# Altium schematic sheet Regulators.SchDoc: Regulators
size B; Organization: Myomo; Address1: 137 PORTLAND STREET, 4TH FLOOR; Address2: BOSTON, MA 02114; Address3: USA; SheetNumber: 2
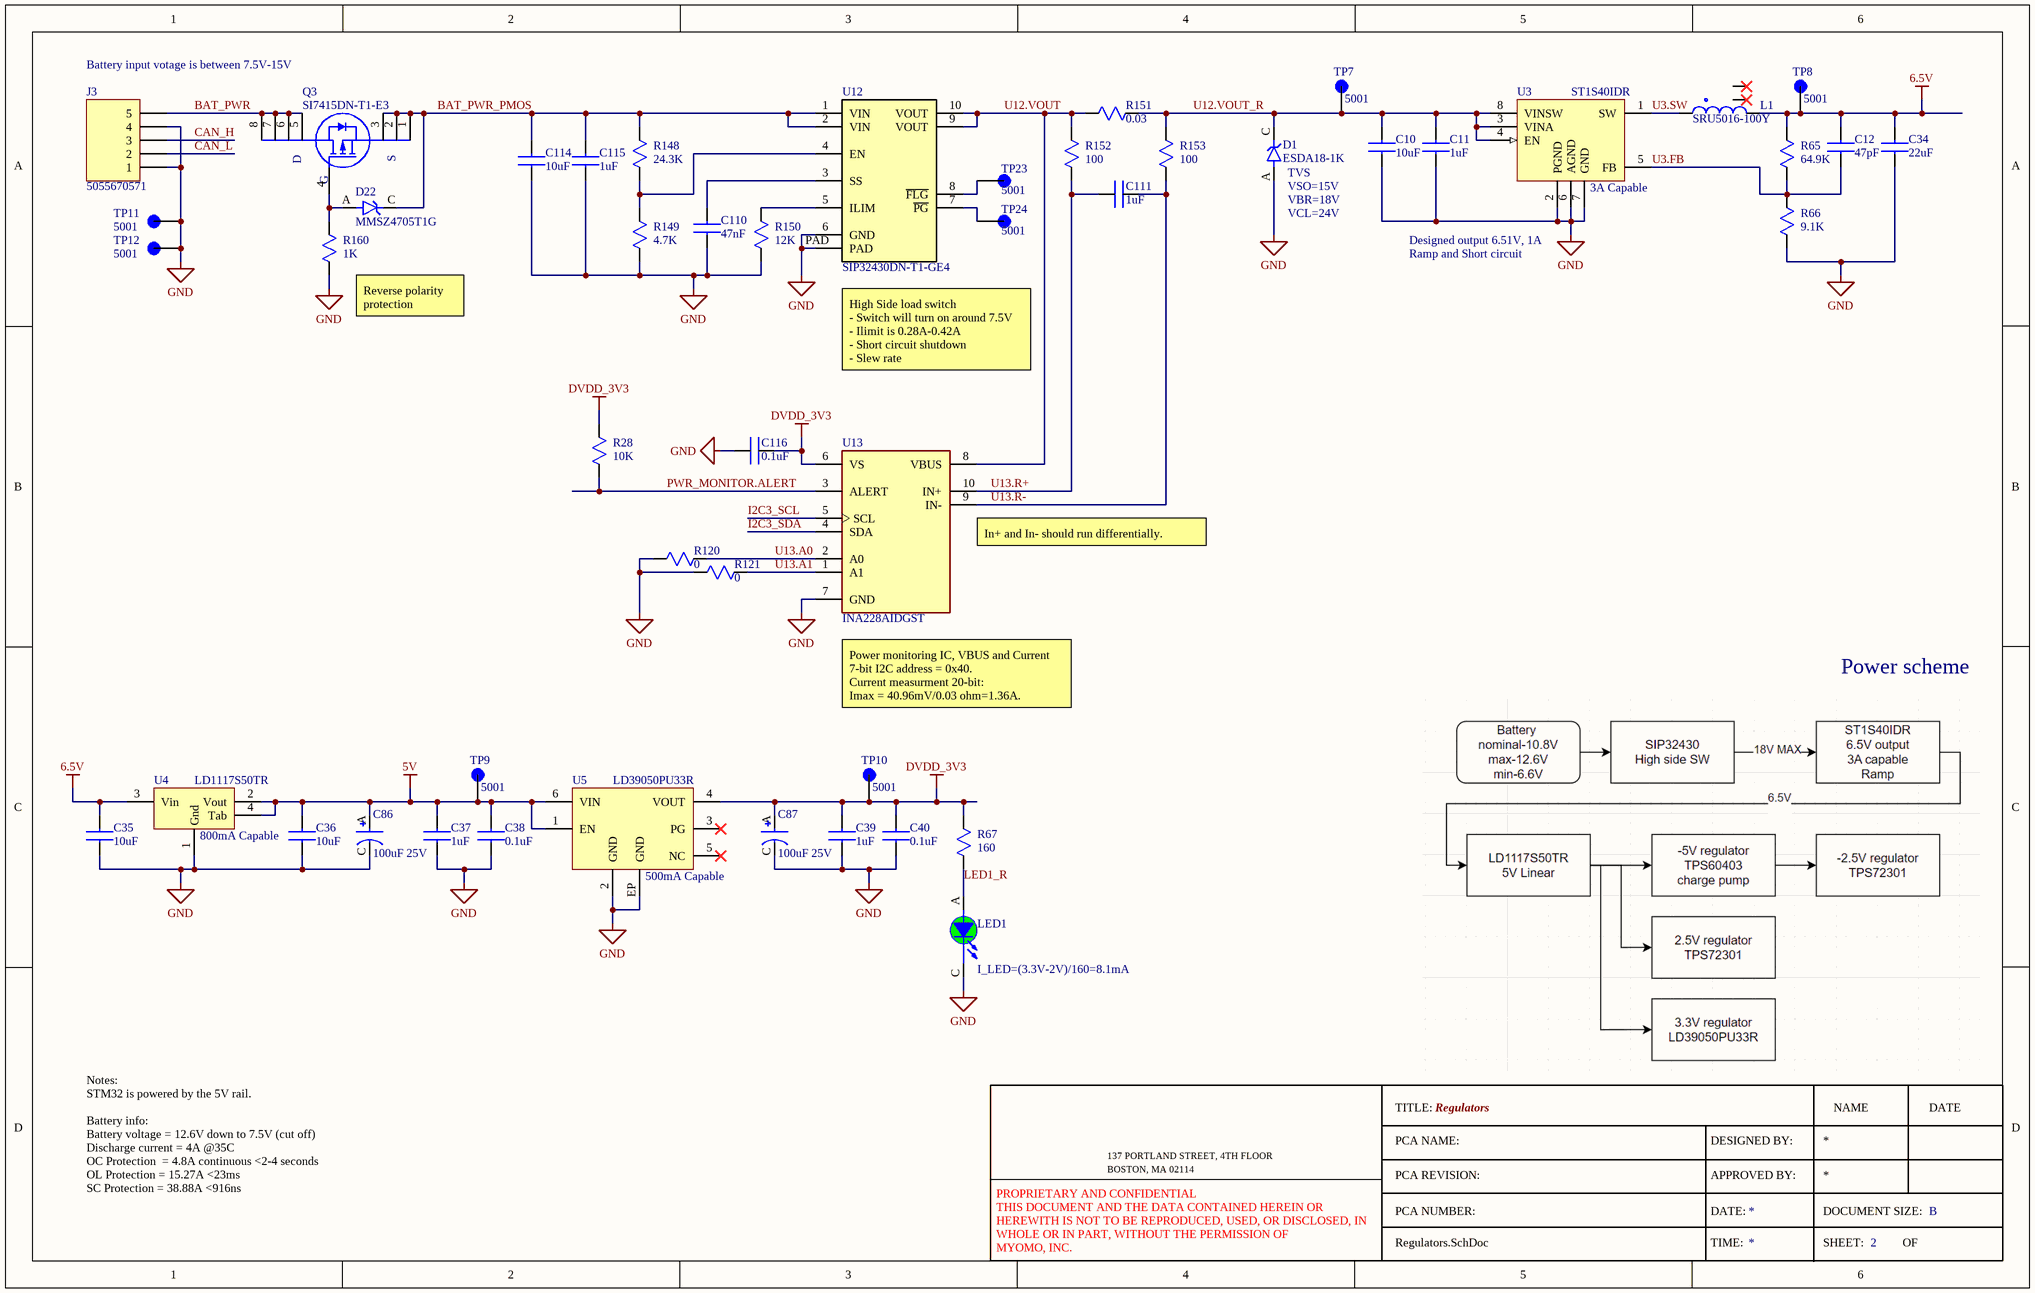
[diagram p0: Regulators.SchDoc]

## Parts
C10  10uF  [1210]
C11  1uF  [0603]
C12  47pF  [0603]
C34  22uF  [1210]
C35  10uF  [1210]
C36  10uF  [1210]
C37  1uF  [0603]
C38  0.1uF  [0402]
C39  1uF  [0603]
C40  0.1uF  [0402]
C86  100uF 25V  [C_2917_TANT_100uF_25V]
C87  100uF 25V  [C_2917_TANT_100uF_25V]
C110  47nF  [0402]
C111  1uF  [0603]
C114  10uF  [1210]
C115  1uF  [0603]
C116  0.1uF  [0402]
D1  ESDA18-1K  [D_TVS_18V_400W]
D22  MMSZ4705T1G  [D_ZENER_18V_500mW]
J3  5055670571  [J_MOLEX_5055670571]
L1  SRU5016-100Y  [L_10UH_84m_1A]
LED1  D_LED_GREEN_LTST  [D_LED_GREEN_LTST]  (value not drawn)
Q3  SI7415DN-T1-E3  [Q_PMOSFET_SI7415DN-T1-E3]
R28  10K  [0402]
R65  64.9K  [0603]
R66  9.1K  [0603]
R67  160  [0603]
R120  0  [0402]
R121  0  [0402]
R148  24.3K  [0402]
R149  4.7K  [0402]
R150  12K  [0402]
R151  0.03  [1206]
R152  100  [0402]
R153  100  [0402]
R160  1K  [0603]
TP7  5001  [TP_CLIP_BLK_5001]
TP8  5001  [TP_CLIP_BLK_5001]
TP9  5001  [TP_CLIP_BLK_5001]
TP10  5001  [TP_CLIP_BLK_5001]
TP11  5001  [TP_CLIP_BLK_5001]
TP12  5001  [TP_CLIP_BLK_5001]
TP23  5001  [TP_CLIP_BLK_5001]
TP24  5001  [TP_CLIP_BLK_5001]
U3  ST1S40IDR  [U_ST1S40IDR]
U4  LD1117S50TR  [U_LD1117S50TR]
U5  LD39050PU33R  [U_LD39050PU33R]
U12  SIP32430DN-T1-GE4  [U_SIP32430DN-T1-GE4]
U13  INA228AIDGST  [U_INA228AIDGS]

## Nets
5V: C36.1 C37.1 C38.1 C86.A TP9.TP U4.2(Vout) U4.4(Tab) U5.1(EN) U5.6(VIN)
6.5V: C12.1 C34.1 C35.1 L1.2 R65.1 TP8.TP U4.3(Vin)
DVDD_3V3: C39.1 C40.1 C87.A C116.2 R28.1 R67.1 TP10.TP U5.4(VOUT) U13.6(VS)
GND: C10.2 C11.2 C34.2 C35.2 C36.2 C37.2 C38.2 C39.2 C40.2 C86.C C87.C C110.2 C114.2 C115.2 C116.1 D1.A J3.1 J3.4 LED1.C(CATHODE) R66.2 R120.1 R121.1 R149.2 R150.2 R160.2 TP11.TP TP12.TP U3.2(PGND) U3.6(AGND) U3.7(GND) U4.1(Gnd) U5.2(GND) U5.EP(GND) U12.6(GND) U12.PAD U13.7(GND)
BAT_PWR: J3.5 Q3.5(D) Q3.6(D) Q3.7(D) Q3.8(D)
BAT_PWR_PMOS: C114.1 C115.1 D22.C Q3.1(S) Q3.2(S) Q3.3(S) R148.1 U12.1(VIN) U12.2(VIN)
CAN_H: J3.3
CAN_L: J3.2
I2C3_SCL: U13.5(SCL)
I2C3_SDA: U13.4(SDA)
LED1_R: LED1.A(ANODE) R67.2
PWR_MONITOR.ALERT: R28.2 U13.3(ALERT)
U3.FB: C12.2 R65.2 R66.1 U3.5(FB)
U3.SW: L1.1 U3.1(SW)
U12.VOUT: R151.1 R152.1 U12.9(VOUT) U12.10(VOUT) U13.8(VBUS)
U12.VOUT_R: C10.1 C11.1 D1.C R151.2 R153.1 TP7.TP U3.3(VINA) U3.4(EN) U3.8(VINSW)
U13.A0: R120.2 U13.2(A0)
U13.A1: R121.2 U13.1(A1)
U13.R+: C111.1 R152.2 U13.10(IN+)
U13.R-: C111.2 R153.2 U13.9(IN-)
NetC110_1: C110.1 U12.3(SS)
NetD22_A: D22.A Q3.4(G) R160.1
NetR148_2: R148.2 R149.1 U12.4(EN)
NetR150_1: R150.1 U12.5(ILIM)
NetTP23_TP: TP23.TP U12.8(~{FLG})
NetTP24_TP: TP24.TP U12.7(~{PG})

Not connected (* = marked no-connect by the designer): L1 MH1* MH2*; U5 3(PG)* 5(NC)*

## Notes on the sheet
- (near J3) Battery input votage is between 7.5V-15V
- (near D1) VBR=18V
- (near D1) VSO=15V
- (near D1) VCL=24V
- (near D1) TVS
- (near U3) 3A Capable
- Designed output 6.51V, 1A
- Ramp and Short circuit
- (near R160) Reverse polarity protection
- (near U12) High Side load switch
  - Switch will turn on around 7.5V
  - Ilimit is 0.28A-0.42A
  - Short circuit shutdown
  - Slew rate
- (near U13) In+ and In- should run differentially.
- (near U13) Power monitoring IC, VBUS and Current
  7-bit I2C address = 0x40.
  Current measurment 20-bit:
  Imax = 40.96mV/0.03 ohm=1.36A.
- Power scheme
- (near U4) 800mA Capable
- (near U5) 500mA Capable
- (near LED1) I_LED=(3.3V-2V)/160=8.1mA
- Notes:
  STM32 is powered by the 5V rail.
  Battery info:
  Battery voltage = 12.6V down to 7.5V (cut off)
  Discharge current = 4A @35C
  OC Protection  = 4.8A continuous <2-4 seconds
  OL Protection = 15.27A <23ms
  SC Protection = 38.88A <916ns
- TITLE:
- NAME
- DATE
- PCA REVISION:
- PCA NAME:
- APPROVED BY:
- DESIGNED BY:
- PCA NUMBER:
- DATE:
- TIME:
- DOCUMENT SIZE:
- SHEET:
- OF
- B
- PROPRIETARY AND CONFIDENTIAL
  THIS DOCUMENT AND THE DATA CONTAINED HEREIN OR HEREWITH IS NOT TO BE REPRODUCED, USED, OR DISCLOSED, IN WHOLE OR IN PART, WITHOUT THE PERMISSION OF
  MYOMO, INC.

## Library data of the parts
C10 C35 C36 C114 = C_1210_CER_10uF_25V_X7R: CAP CER 10UF 25V X7R 1210; MFG: SUMSUNG; MFGPN: CL32B106KAJNNNE; Myomo PN: 201-0004
C11 C37 C39 C111 C115 = C_0603_CER_1uF_50V_X7R: CAP CER 1UF 50V X7R 0603; MFG: YAGEO; MFGPN: CC0603KRX7R9BB105; Myomo PN: 201-0006
C12 = C_0603_CER_47pF_100V_COG: CAP CER 47PF 100V C0G/NP0 0603; MFG: KEMET; MFGPN: C0603C470J1GACTU; Myomo PN: 201-0011
C34 = C_1210_CER_22uF_25V_X7R: CAP CER 22UF 25V X7R 1210; MFG: SUMSUNG; MFGPN: CL32B226KAJNFNE; Myomo PN: 201-0007
C38 C40 C116 = C_0402_CER_0.1uF_50V_X7R: CAP CER 0.1UF 50V X7R 0402; MFG: Samsung; MFGPN: CL05B104KB54PNC; Myomo PN: 201-0017
C86 C87 = C_2917_TANT_100uF_25V: CAP TANT POLY 100UF 25V 2917; MFG: AVX Corporation; MFGPN: TCJD107M025R0070; Myomo PN: 201-0014
C110 = C_0402_CER_47nF_50V_X7R: CAP CER 47nF 50V X7R 0402; MFG: TDK; MFGPN: CGA2B3X7R1H473K050BB; Myomo PN: 201-0018
D1 = D_TVS_18V_400W: TVS DIODE 15VWM 34VC SOD523; MFG: STMicroelectronics; Myomo PN: 203-0003; MFGPN: ESDA18-1K
D22 = D_ZENER_18V_500mW: DIODE ZENER 18V 500MW SOD123; MFG: Onsemi; Myomo PN: 203-0008; MFGPN: MMSZ4705T1G
J3 = J_MOLEX_5055670571: CONN HEADER SMD R/A 5POS 1.25MM; MFG: Molex; Myomo PN: 211-0012; MFGPN: 5055670571; ComponentLink1Description: New link; ComponentLink1URL: *
L1 = L_10UH_84m_1A: FIXED IND 10UH 1A 84 MOHM SMD; MFG: Bourns Inc.; Myomo PN: 202-0003; MFGPN: SRU5016-100Y
LED1 = D_LED_GREEN_LTST: LED GREEN CLEAR 0603 SMD; Myomo PN: 203-0004; MFG: Lite-On Inc.; MFGPN: LTST-C191KGKT; Supplier 1: Digi-Key; Supplier Part Number 1: 160-1446-1-ND
Q3 = Q_PMOSFET_SI7415DN-T1-E3: MOSFET P-CH 60V 3.6A PPAK1212-8; MFG: Vishay; Myomo PN: 208-0002; Supplier 1: Digi-Key; MFGPN: SI7415DN-T1-E3; Supplier Part Number 1: MMUN2211LT1GOSCT-ND
R28 = R_0402_10K_1%_1/10W: RES SMD 10K OHM 1% 1/10W 0402; MFG: Panasonic; MFGPN: ERJ-2RKF1002X; Myomo PN: 200-0021
R65 = R_0603_64.9K_1%_1/10W: RES 64.9K OHM 1% 1/10W 0603; MFG: YAGEO; MFGPN: RC0603FR-0764K9L; Myomo PN: 200-0011
R66 = R_0603_9.1K_1%_1/10W: RES 9.1K OHM 1% 1/10W 0603; MFG: YAGEO; MFGPN: RC0603FR-079K1L; Myomo PN: 200-0010
R67 = R_0603_160_1%_1/10W: RES 160 OHM 1% 1/10W 0603; MFG: YAGEO; MFGPN: RC0603FR-07160RL; Myomo PN: 200-0012
R120 R121 = R_0402_0: RES 0 OHM JUMPER 1/10W 0402; MFG: YAGEO; MFGPN: RC0402FR-070RL; Myomo PN: 200-0018
R148 = R_0402_24.3K_1%_1/10W: RES SMD 24.3K OHM 1% 1/10W 0402; MFG: Panasonic; MFGPN: ERJ-2RKF2432X; Myomo PN: 200-0023
R149 = R_0402_4.7K_1%_1/10W: RES SMD 4.7K OHM 1% 1/10W 0402; MFG: Panasonic; MFGPN: ERJ-2RKF4701X; Myomo PN: 200-0022
R150 = R_0402_12K_1%_1/10W: RES SMD 12K OHM 1% 1/10W 0402; MFG: Panasonic; MFGPN: ERJ-2RKF1202X; Myomo PN: 200-0021
R151 = R_1206_0.03_0.5%_1W: RES 0.03 OHM 0.5% 1W 1206; MFG: Vishay; MFGPN: WSLP1206R0300DEA; Myomo PN: 200-0025
R152 R153 = R_0402_100_1%_1/10W: RES SMD 100 OHM 1% 1/10W 0402; MFG: Panasonic; MFGPN: ERJ-2RKF1000X; Myomo PN: 200-0019
R160 = R_0603_1K_1%_1/10W: RES 1K OHM 1% 1/10W 0603; MFG: YAGEO; MFGPN: RC0603FR-071KL; Myomo PN: 200-0029
TP7-TP12 TP23 TP24 = TP_CLIP_BLK_5001: PC TEST POINT MINIATURE BLACK; MFG: Keystone Electronics; Myomo PN: 213-0001; MFGPN: 5001
U3 = U_ST1S40IDR: IC REG BUCK ADJ 3A 8SOIC; MFG: STMicroelectronics; Myomo PN: 204-0004; MFGPN: ST1S40IDR; Supplier 1: Digikey; Supplier Part Number 1: 497-12968-1-ND
U4 = U_LD1117S50TR: IC REG LINEAR 5V 800MA SOT223; MFG: STMICROELECTRONICS; Myomo PN: 204-0006; MFGPN: LD1117S50TR; ComponentLink1Description: Datasheet; ComponentLink1URL: http://tunmcdsvn.tun.st.com/Component_Datasheet_Library/Trunk/IC/STM_LDO_LD1117
U5 = U_LD39050PU33R: IC REG LINEAR 3.3V 500MA 6DFN; MFG: STMICROELECTRONICS; Myomo PN: 204-0005; MFGPN: LD39050PU33R; ComponentLink1Description: Datasheet; ComponentLink1URL: http://tunmcdsvn.tun.st.com/Component_Datasheet_Library/Trunk/IC/STM_LDO_LD1117
U12 = U_SIP32430DN-T1-GE4: HIGH SIDE SWITCH - IC PWR SWITCH P-CHAN 1:1 10DFN; MFG: Vishay; Myomo PN: 204-0013; MFGPN: SIP32430DN-T1-GE4
U13 = U_INA228AIDGS: IC REG BUCK ADJ 3A 8SOIC; MFG: TI; Myomo PN: 204-0014; MFGPN: INA228AIDGST; Supplier 1: Digikey; Supplier Part Number 1: 296-INA228AIDGSTDKR-ND